# EAGLE design ukmarsbot-line-sensor-basic (EAGLE 7.6.0)
CNAME: UKMARSBOT; CREVISION: v1.2; DESIGNER: Ian Butterworth
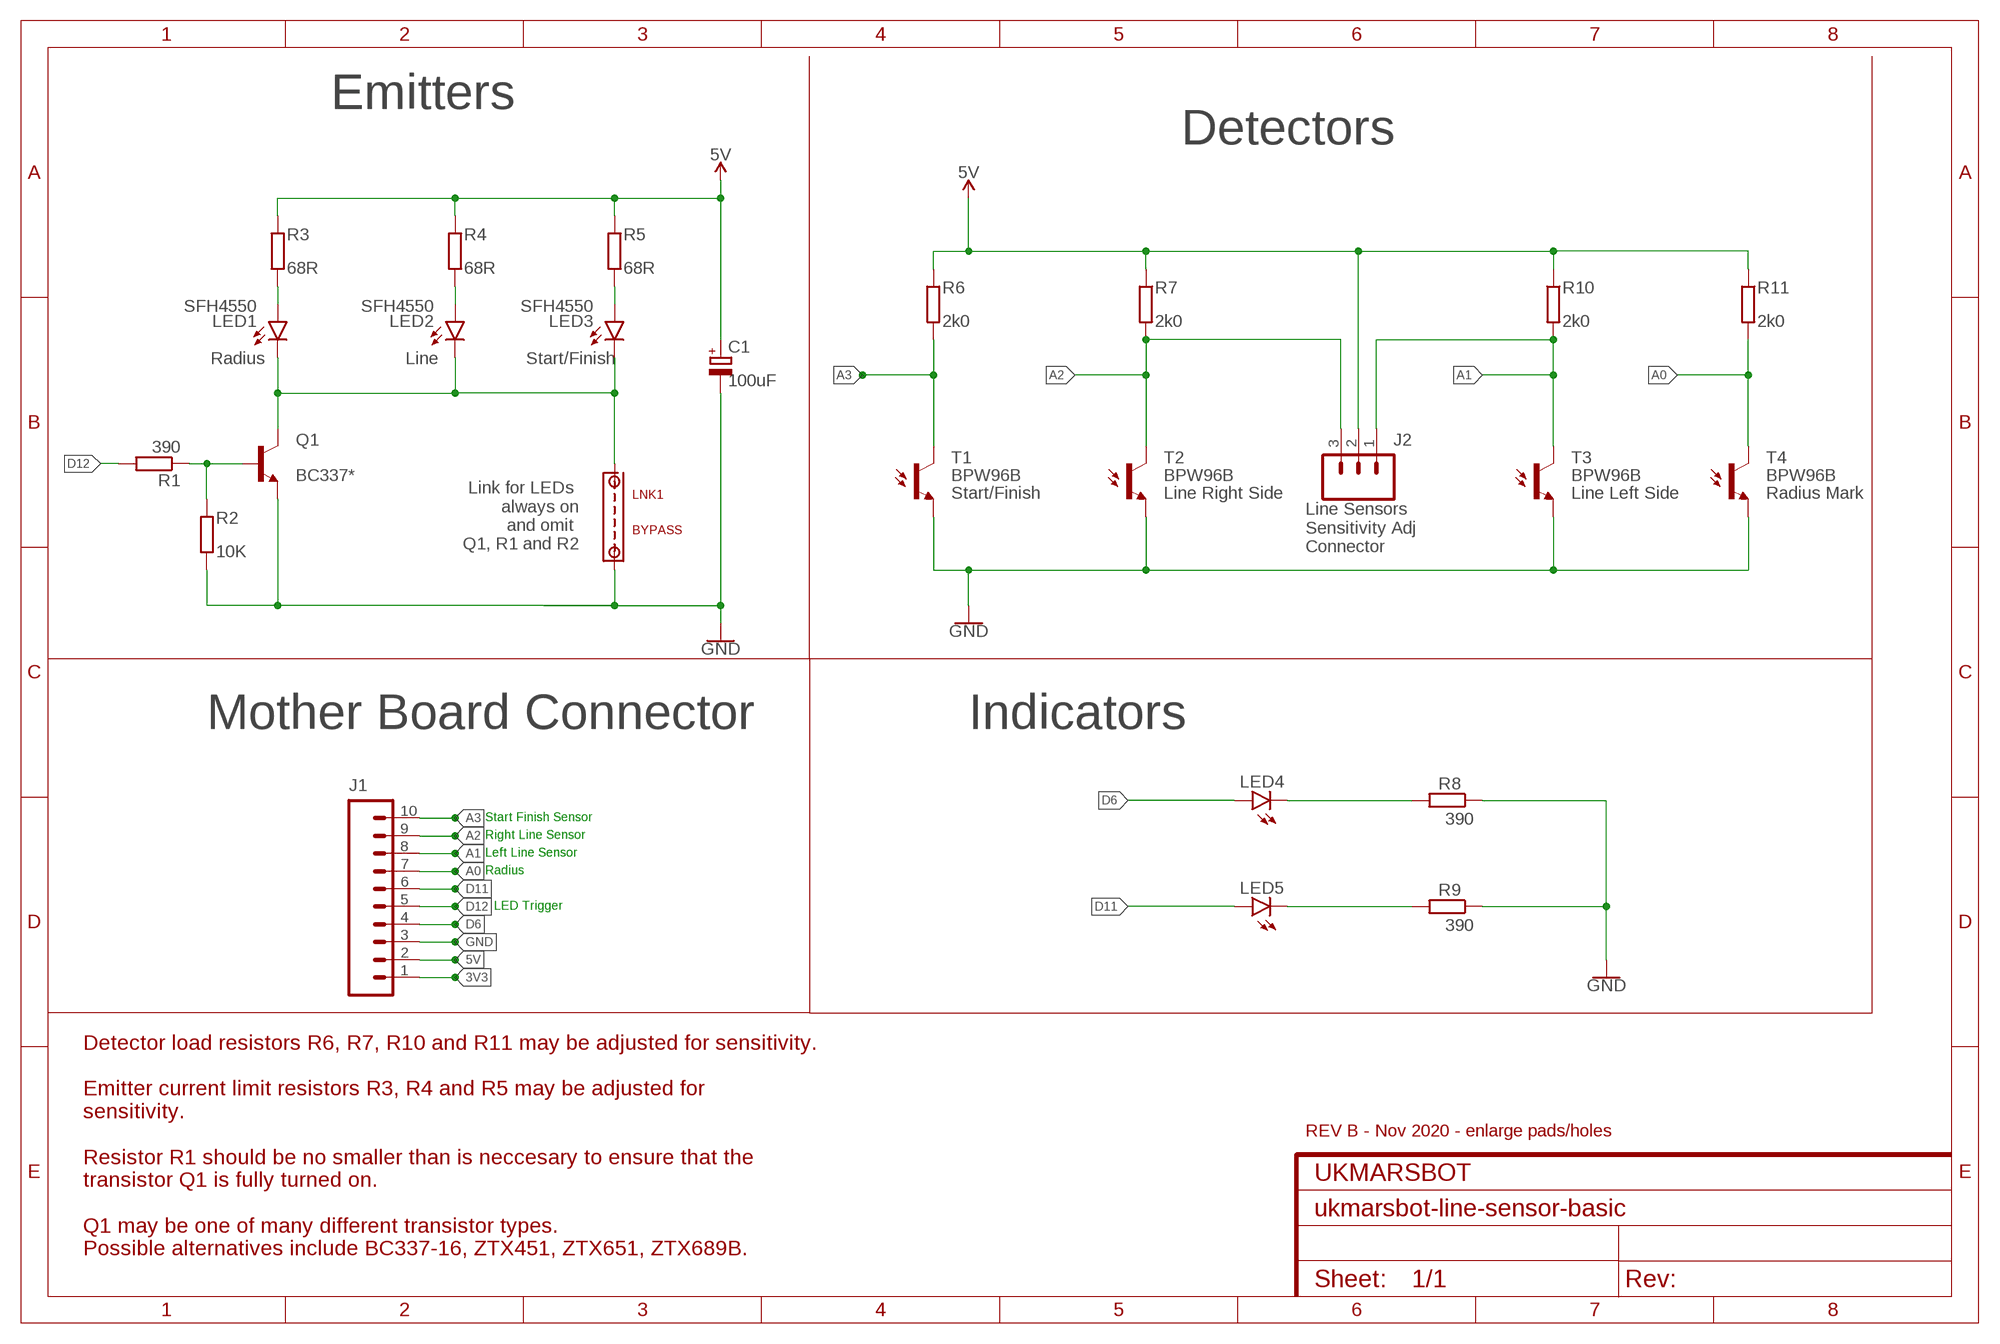
[diagram p0: schematic, sheet 1]

## Parts
C1  100uF  CPOL-EUE2.5-7  [E2,5-7]
J1  CONN_10"  [1X10]
J2  CONN_03  [1X03]
LED1  SFH4550  LED5MM  [LED_5MM]
LED2  SFH4550  LED5MM  [LED_5MM]
LED3  SFH4550  LED5MM  [LED_5MM]
LED4  LED3MM  [LED_3MM]
LED5  LED3MM  [LED_3MM]
LNK1  BYPASS  LINK  [LINK-03]
Q1  BC337*  TRANS_NPN  [TO92-EBC]
R1  390  R-EU_0207/7  [0207/7]
R2  10K  R-EU_0207/7  [0207/7]
R3  68R  R-EU_0207/7  [0207/7]
R4  68R  R-EU_0207/7  [0207/7]
R5  68R  R-EU_0207/7  [0207/7]
R6  2k0  R-EU_0207/7  [0207/7]
R7  2k0  R-EU_0207/7  [0207/7]
R8  390  R-EU_0207/7  [0207/7]
R9  390  R-EU_0207/7  [0207/7]
R10  2k0  R-EU_0207/7  [0207/7]
R11  2k0  R-EU_0207/7  [0207/7]
T1  BPW96B  PHOTOTRANSISTOR5MM  [PHOTOTRANSISTOR_5MM]
T2  BPW96B  PHOTOTRANSISTOR5MM  [PHOTOTRANSISTOR_5MM]
T3  BPW96B  PHOTOTRANSISTOR5MM  [PHOTOTRANSISTOR_5MM]
T4  BPW96B  PHOTOTRANSISTOR5MM  [PHOTOTRANSISTOR_5MM]

## Nets
3V3: J1.1
5V [power]: C1.+ J1.2 J2.2 R3.2 R4.2 R5.2 R6.1 R7.1 R10.1 R11.1
A0: J1.7 R11.2 T4.C
A1: J1.8 J2.1 R10.2 T3.C
A2: J1.9 J2.3 R7.2 T2.C
A3: J1.10 R6.2 T1.C
D6: J1.4 LED4.A
D11: J1.6 LED5.A
D12: J1.5 R1.2
GND [power]: C1.- J1.3 LNK1.2 Q1.E R2.1 R8.1 R9.1 T1.E T2.E T3.E T4.E
N$1: Q1.B R1.1 R2.2
N$2 [emitters]: LED1.K(C) LED2.K(C) LED3.K(C) LNK1.1 Q1.C
N$3: LED5.K(C) R9.2
N$4: LED4.K(C) R8.2
N$5 [emitters]: LED1.A R3.1
N$6 [emitters]: LED2.A R4.1
N$7 [emitters]: LED3.A R5.1

## Notes on the sheet
- Emitters
- Detectors
- Radius | Line | Start/Finish
- Link for LEDs 
  always on
  and omit 
  Q1, R1 and R2
- Start/Finish | Line Right Side | Line Left Side | Radius Mark
- Line Sensors
  Sensitivity Adj
  Connector
- Mother Board Connector | Indicators
- Start Finish Sensor
- Right Line Sensor
- Left Line Sensor
- Radius
- LED Trigger
- REV B - Nov 2020 - enlarge pads/holes
- Detector load resistors R6, R7, R10 and R11 may be adjusted for sensitivity.
  
  Emitter current limit resistors R3, R4 and R5 may be adjusted for 
  sensitivity.
  
  Resistor R1 should be no smaller than is neccesary to ensure that the 
  transistor Q1 is fully turned on.
  
  Q1 may be one of many different transistor types. 
  Possible alternatives include BC337-16, ZTX451, ZTX651, ZTX689B.

## Library data of the parts
C1 = ukmarsbot:CPOL-EU: POLARIZED CAPACITOR, European symbol
J1 = ukmarsbot:CONN_10: Multi connection point. Often used as Generic Header-pin footprint for 0.1 inch spaced/style header connections On any of the 0.1 inch spaced packages, you can populate with these: Break Away Headers - Straight <https://www.sparkfun.com/products/116> (PRT-00116) Break Away Male Headers - Right Angle <https://www.sparkfun.com/products/553> (PRT-00553) Female Headers <https://www.sparkfun.com/products/115> (PRT-00115) Break Away Headers - Machine Pin <https://www.sparkfun.com/products/117> (PRT-00117) Break Away Female Headers - Swiss Machine Pin <https://www.sparkfun.com/products/743> (PRT-00743) Arduino Stackable Header - 10 Pin <https://www.sparkfun.com/products/11376> (PRT-11376) For SCREWTERMINALS and SPRING TERMINALS visit here: Screw Terimnals on SparkFun.com <https://www.sparkfun.com/search/results?term=Screw+Terminals> (5mm/3.5mm/2.54mm spacing) This device is also useful as a general connection point to wire up your design to another part of your project. Our various solder wires solder well into these plated through hole pads. Hook-Up Wire - Assortment (Stranded, 22 AWG) <https://www.sparkfun.com/products/11375> (PRT-11375) Hook-Up Wire - Assortment (Solid Core, 22 AWG) <https://www.sparkfun.com/products/11367> (PRT-11367) View the entire wire category on our website here <https://www.sparkfun.com/categories/141> Special notes: Molex polarized connector foot print use with SKU : PRT-08231 with associated crimp pins and housings. 1MM SMD Version SKU: PRT-10208 NOTES ON THE VARIANTS LOCK and LOCK_LONGPADS... This footprint was designed to help hold the alignment of a through-hole component (i.e. 6-pin header) while soldering it into place. You may notice that each hole has been shifted either up or down by 0.005 of an inch from it's more standard position (which is a perfectly straight line). This slight alteration caused the pins (the squares in the middle) to touch the edges of the holes. Because they are alternating, it causes a "brace" to hold the component in place. 0.005 has proven to be the perfect amount of "off-center" position when using our standard breakaway headers. Although looks a little odd when you look at the bare footprint, once you have a header in there, the alteration is very hard to notice. Also,if you push a header all the way into place, it is covered up entirely on the bottom side.; PROD_ID: CONN-11563
J2 = ukmarsbot:CONN_03: Multi connection point. Often used as Generic Header-pin footprint for 0.1 inch spaced/style header connections On any of the 0.1 inch spaced packages, you can populate with these: Break Away Headers - Straight <https://www.sparkfun.com/products/116> (PRT-00116) Break Away Male Headers - Right Angle <https://www.sparkfun.com/products/553> (PRT-00553) Female Headers <https://www.sparkfun.com/products/115> (PRT-00115) Break Away Headers - Machine Pin <https://www.sparkfun.com/products/117> (PRT-00117) Break Away Female Headers - Swiss Machine Pin <https://www.sparkfun.com/products/743> (PRT-00743) Stackable Header - 3 Pin (Female, 0.1") <https://www.sparkfun.com/products/13875> (PRT-13875) For SCREWTERMINALS and SPRING TERMINALS visit here: Screw Terimnals on SparkFun.com <https://www.sparkfun.com/search/results?term=Screw+Terminals> (5mm/3.5mm/2.54mm spacing) This device is also useful as a general connection point to wire up your design to another part of your project. Our various solder wires solder well into these plated through hole pads. Hook-Up Wire - Assortment (Stranded, 22 AWG) <https://www.sparkfun.com/products/11375> (PRT-11375) Hook-Up Wire - Assortment (Solid Core, 22 AWG) <https://www.sparkfun.com/products/11367> (PRT-11367) View the entire wire category on our website here <https://www.sparkfun.com/categories/141> Special notes: Molex polarized connector foot print use with SKU : PRT-08232 with associated crimp pins and housings.; PROD_ID: XXX-00000; VALUE: 455-1750-1-ND
LED1-LED3 = ukmarsbot:LED: LED (Generic) Standard schematic elements and footprints for 5mm, 3mm, 1206, and 0603 sized LEDs. Generic LEDs with no color specified.
LED4 LED5 = ukmarsbot:LED: LED (Generic) Standard schematic elements and footprints for 5mm, 3mm, 1206, and 0603 sized LEDs. Generic LEDs with no color specified.; PROD_ID: DIO-08794
LNK1 = ukmarsbot:LINK
Q1 = ukmarsbot:TRANS_NPN: NPN transistor Current controlled devices typically used to amplify current or used as a switch. BC547 - COM-08928 <http://www.sparkfun.com/products/8928> (TO-92 45V 100mA) (1.Collector 2.Base 3.Emitter) 2N3904 - COM-00521 <http://www.sparkfun.com/products/521> (TO-92 40V 200mA) (1.Emitter 2.Base 3.Collector) P2N2222A - COM-12852 <http://www.sparkfun.com/products/12852> (TO-92 40V 600mA) (1.Collector 2.Base 3.Emitter)
R1-R11 = ukmarsbot:R-EU_: RESISTOR
T1-T4 = ukmarsbot:PHOTOTRANSISTOR: Phototransistor

## Net classes
0 default: width 0.406 mm
1 power: width 0.813 mm
2 emitters: width 0.61 mm

## Board
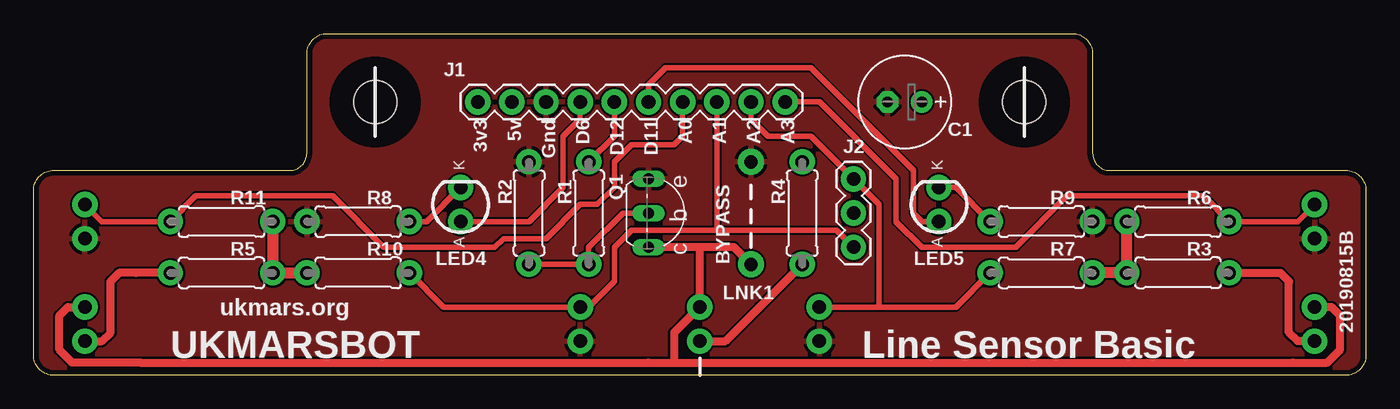
[diagram p1: board, top side]
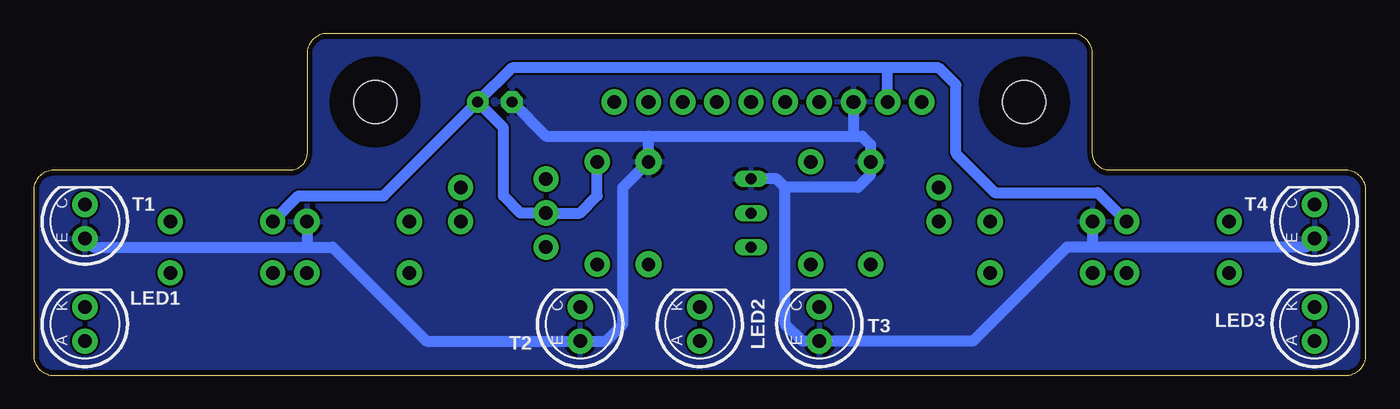
[diagram p2: board, bottom side, seen from below]

Size 99.06 x 25.4 mm. Coordinates in mm from the lower left corner, seen from the top.
Outline: 99.06,13.74 99.06,1.5 arc-90 97.56,0 1.5,0 arc-90 0,1.5 0,13.74 arc-90 1.5,15.24 19.05,15.24 arc90 20.32,16.51 20.32,23.9 arc-90 21.82,25.4 77.24,25.4 arc-90 78.74,23.9 78.74,16.51 arc90 80.01,15.24 97.56,15.24 arc-90 99.06,13.74
Copper layers (1*16): Top 0.035559375mm / dielectric 1.6mm / Bottom 0.035559375mm
Design rules "osh-park": minimum track width 6mil, minimum drill 10mil, track to track 6mil, track to pad 6mil, pad to pad 6mil, via to via 6mil, smd to smd 6mil, copper to edge 15mil, drill to drill 6mil, minimum pad ring 5mil, minimum via ring 5mil, stop-mask expansion 2.5mil, vias tented up to drill 0mil, thermal gap 10mil
Holes 3.2 mm at 25.4,20.32 73.66,20.32
tRestrict: area 22.2,17.1 to 28.6,23.5; area 70.5,17.1 to 76.8,23.5
bRestrict: area 22.2,17.1 to 28.6,23.5; area 70.5,17.1 to 76.8,23.5

### Footprints (pad centres in the part's own frame; a part is rotated, then mirrored left to right if it is on the bottom)
E2,5-7 = drill 0.813 pad 1.6: + -1.27,0 | drill 0.813 pad 1.6 octagon: - 1.27,0
1X10 = drill 1.016 pad 1.88: 1 0,0; 2 2.54,0; 3 5.08,0; 4 7.62,0; 5 10.16,0; 6 12.7,0; 7 15.24,0; 8 17.78,0; 9 20.32,0; 10 22.86,0
1X03 = drill 1 pad 1.88: 1 0,0; 2 2.54,0; 3 5.08,0
LED_5MM = drill 1 pad 1.88: A -1.27,0; K 1.27,0
LED_3MM = drill 1 pad 1.88: A -1.27,0; K 1.27,0
LINK-03 = drill 1 pad 1.93: 1 0,0; 2 7.62,0
TO92-EBC = drill 0.813 long: B 0,-1.27; C 2.54,-1.27; E -2.54,-1.27
0207/7 = drill 1 pad 1.88: 1 -3.81,0; 2 3.81,0
PHOTOTRANSISTOR_5MM = drill 1 pad 1.88: C 1.27,0; E -1.27,0

### Placement (x,y rotation side)
C1  64.77,20.32 180 top
J1  33.02,20.32 0 top
J2  60.96,9.53 90 top
LED1  95.25,3.81 90 bottom
LED2  49.53,3.81 90 bottom
LED3  3.81,3.81 90 bottom
LED4  31.75,12.7 90 top
LED5  67.31,12.7 90 top
LNK1  53.34,8.26 90 top
Q1  46.99,12.06 270 top
R1  41.27,12.06 90 top
R2  36.83,12.06 270 top
R3  85.09,7.62 180 top
R4  57.15,12.06 90 top
R5  13.97,7.62 0 top
R6  85.09,11.43 0 top
R7  74.93,7.62 180 top
R8  24.13,11.43 0 top
R9  74.93,11.43 180 top
R10  24.13,7.62 0 top
R11  13.97,11.43 180 top
T1  95.25,11.43 90 bottom
T2  58.42,3.81 90 bottom
T3  40.64,3.81 90 bottom
T4  3.81,11.43 90 bottom

### Tracks (layer width: path | path; a pad name or v marks a point on that pad's centre or on a via)
5V
  Top 0.813: R6.1 R3.2 R7.1 | R10.1 R5.2 R11.1
  Bottom 0.813: R4.2 57.15,13.34 58.42,12.06 J2.2 62.87,12.06 64.14,13.34 64.14,18.41 C1.+ | C1.+ 73.03,13.34 79.38,13.34 R6.1 | 35.56,22.86 31.75,22.86 30.48,21.59 30.48,16.48 27.59,13.59 19.93,13.59 R11.1 | 35.56,22.86 63.5,22.86 C1.+ | J1.2 35.56,22.86
A0
  Top 0.406: T4.C 5.08,11.43 R11.2 12.06,13.34 22.23,13.34 26.04,9.53 34.29,9.53 34.92,10.16 38.1,10.16 40.64,12.7 41.91,12.7 43.18,13.97 43.18,15.88 44.45,17.14 47.62,17.14 48.26,17.78 J1.7
A1
  Top 0.406: R10.2 30.48,5.08 T3.C 41.27,5.08 43.18,6.99 43.18,9.53 44.45,10.79 46.99,10.79 50.8,10.79 | J1.8 50.8,14.61 50.8,10.79 | 50.8,10.79 59.69,10.79 J2.1
A2
  Top 0.406: R7.2 68.58,5.08 63.5,5.08 62.87,5.08 | 62.87,5.08 T2.C | 62.87,5.08 62.87,12.7 J2.3 57.78,17.78 56.52,17.78 54.61,17.78 53.34,19.05 J1.9
A3
  Top 0.406: T1.C 93.98,11.43 R6.2 87,13.34 76.83,13.34 73.03,9.53 66.04,9.53 64.14,11.43 64.14,14.61 58.42,20.32 J1.10
D6
  Top 0.406: J1.4 40.64,19.05 39.37,17.78 39.37,13.97 36.83,11.43 LED4.A
D11
  Top 0.406: J1.6 45.72,21.59 46.35,22.23 46.99,22.86 47.62,22.86 57.78,22.86 65.41,15.24 65.41,14.61 65.41,13.34 65.41,12.06 66.04,11.43 LED5.A
D12
  Top 0.406: R1.2 43.18,17.78 J1.5
GND
  Bottom 0.813: T1.E 94.61,9.53 78.74,9.53 | T4.E 4.45,9.53 20.32,9.53 | 20.32,9.53 22.23,9.53 29.21,2.54 T3.E 41.91,2.54 43.18,3.81 43.18,13.97 | R8.1 20.32,9.53 | 78.74,9.53 76.83,9.53 69.85,2.54 T2.E 56.52,2.54 55.24,3.81 55.24,13.97 LNK1.2 53.34,17.78 | R9.1 78.74,9.53 | C1.- 60.96,17.78 53.34,17.78 | 53.34,17.78 38.1,17.78 | 38.1,17.78 37.47,17.78 36.83,17.14 R2.1 36.83,14.92 37.78,13.97 43.18,13.97 | J1.3 38.1,17.78 | 43.18,13.97 43.81,14.61 Q1.E
  pour Top: 0,0 0,15.24 20.32,15.24 20.32,26.04 78.74,26.04 78.74,15.24 99.06,15.24 99.06,0
  pour Bottom: 0,0 0,15.24 20.32,15.24 20.18,26.67 78.61,26.67 78.74,15.24 99.06,15.24 99.06,0
N$1
  Top 0.406: R2.2 R1.1 41.27,9.53 43.81,12.06 Q1.B
N$2
  Top 0.61: 47.62,0.95 45.72,0.95 7.94,0.95 5.4,0.95 2.86,0.95 1.91,1.91 1.91,4.45 2.54,5.08 LED3.K | 47.62,0.95 49.53,0.95 93.66,0.95 96.2,0.95 97.16,1.91 97.16,4.45 96.52,5.08 LED1.K | LNK1.1 52.07,9.53 49.53,9.53 | 49.53,9.53 Q1.C | 49.53,9.53 LED2.K 48.26,3.81 47.62,3.17 47.62,0.95
N$3
  Top 0.406: LED5.K 68.58,13.97 R9.2
N$4
  Top 0.406: R8.2 29.21,11.43 LED4.K
N$5
  Top 0.61: R3.1 92.71,7.62 93.34,6.99 93.34,3.17 93.98,2.54 LED1.A
N$6
  Top 0.61: R4.1 53.98,5.08 51.44,2.54 LED2.A
N$7
  Top 0.61: R5.1 7.62,7.62 6.35,7.62 5.71,6.99 5.71,3.17 5.08,2.54 LED3.A

### Text on the board
tPlace: ukmars.org | 20190815B | UKMARSBOT | Line Sensor Basic
tNames: 3v3 | 5v | Gnd | D6 | D12 | D11 | A0 | A1 | A2 | A3